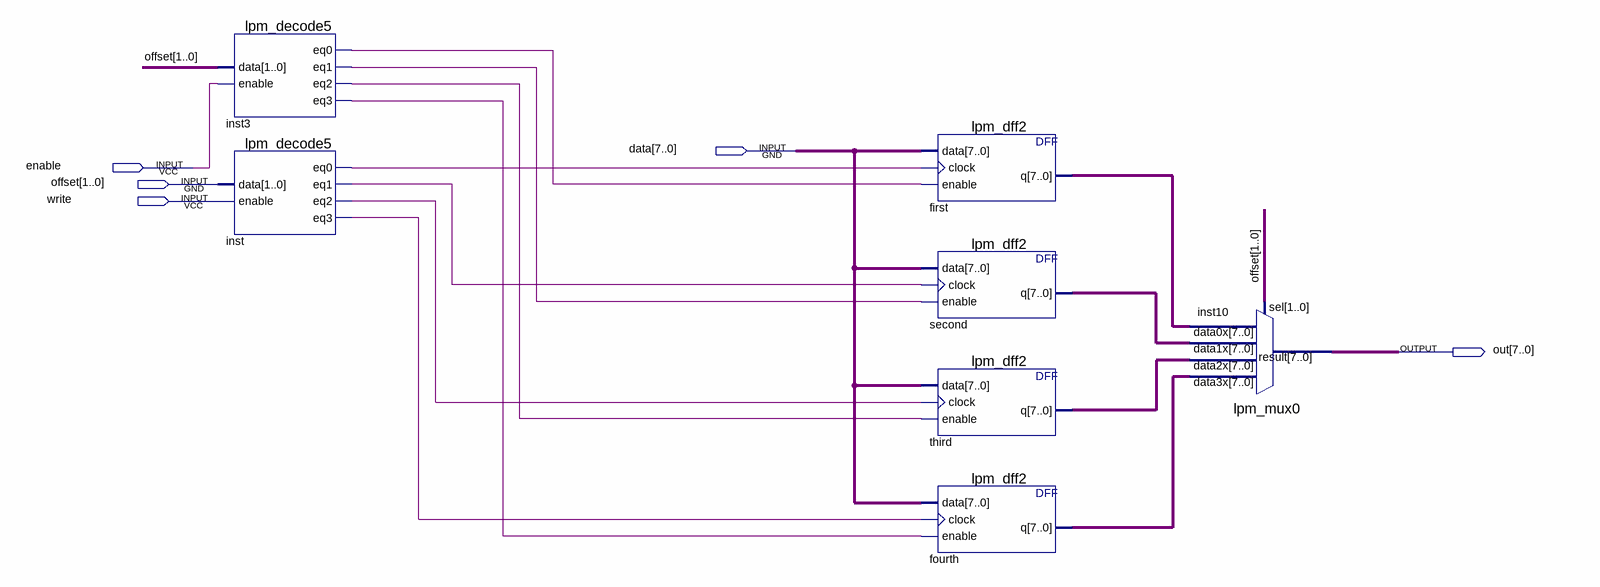
[diagram p0: schematic sheet]
// Quartus schematic string.bdf as structural Verilog: 7 symbols, 5 pins
module \string  (
  input  [7:0] data,
  input  enable,
  input  [1:0] offset,
  input  write,
  output [7:0] out
);

  wire inst3_eq0, inst3_eq1, inst3_eq2, inst3_eq3, inst_eq0, inst_eq1, inst_eq2, inst_eq3;
  wire [7:0] first_q, fourth_q, second_q, third_q;

  lpm_decode5 inst3 (
    .data(offset), .enable(enable), .eq0(inst3_eq0), .eq1(inst3_eq1), .eq2(inst3_eq2), .eq3(inst3_eq3));
  lpm_decode5 inst (.data(offset), .enable(write), .eq0(inst_eq0), .eq1(inst_eq1), .eq2(inst_eq2), .eq3(inst_eq3));
  lpm_dff2 first (.data(data), .clock(inst_eq0), .enable(inst3_eq0), .q(first_q));
  lpm_dff2 second (.data(data), .clock(inst_eq1), .enable(inst3_eq1), .q(second_q));
  lpm_dff2 third (.data(data), .clock(inst_eq2), .enable(inst3_eq2), .q(third_q));
  lpm_dff2 fourth (.data(data), .clock(inst_eq3), .enable(inst3_eq3), .q(fourth_q));
  lpm_mux0 inst10 (
    .data3x(fourth_q), .data2x(third_q), .data1x(second_q), .data0x(first_q), .sel(offset), .result(out));
endmodule
